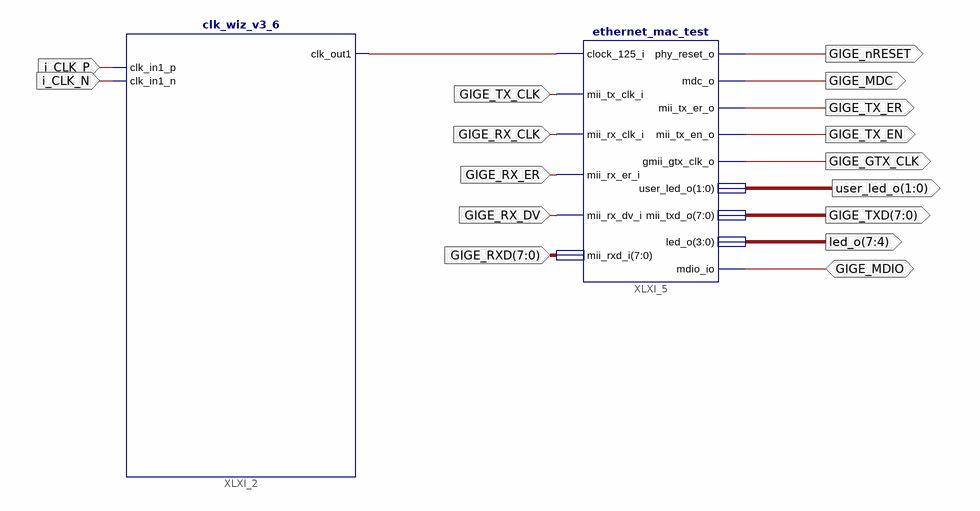
[diagram p0: schematic sheet 1]
// Xilinx ISE schematic eth_mac_test_rhino_top.sch (spartan6) as structural Verilog: 2 symbols, 16 ports
module eth_mac_test_rhino_top (
  input  GIGE_RX_ER,
  input  GIGE_RX_DV,
  input  [7:0] GIGE_RXD,
  input  i_CLK_P,
  input  i_CLK_N,
  input  GIGE_TX_CLK,
  input  GIGE_RX_CLK,
  inout  GIGE_MDIO,
  output GIGE_nRESET,
  output GIGE_MDC,
  output GIGE_TX_ER,
  output GIGE_TX_EN,
  output GIGE_GTX_CLK,
  output [1:0] user_led_o,
  output [7:4] led_o,
  output [7:0] GIGE_TXD
);

  wire XLXN_25;

  clk_wiz_v3_6 XLXI_2 (.clk_in1_p(i_CLK_P), .clk_in1_n(i_CLK_N), .clk_out1(XLXN_25));
  ethernet_mac_test XLXI_5 (
    .clock_125_i(XLXN_25), .mii_tx_clk_i(GIGE_TX_CLK), .mii_rx_clk_i(GIGE_RX_CLK), .mii_rx_er_i(GIGE_RX_ER),
    .mii_rx_dv_i(GIGE_RX_DV), .mii_rxd_i(GIGE_RXD), .phy_reset_o(GIGE_nRESET), .mdc_o(GIGE_MDC),
    .mii_tx_er_o(GIGE_TX_ER), .mii_tx_en_o(GIGE_TX_EN), .gmii_gtx_clk_o(GIGE_GTX_CLK), .mdio_io(GIGE_MDIO),
    .mii_txd_o(GIGE_TXD), .user_led_o(user_led_o), .led_o(led_o));
endmodule
